# Altium schematic sheet Power Board.3.SchDoc
size A4; SheetNumber: 2; SheetTotal: 2
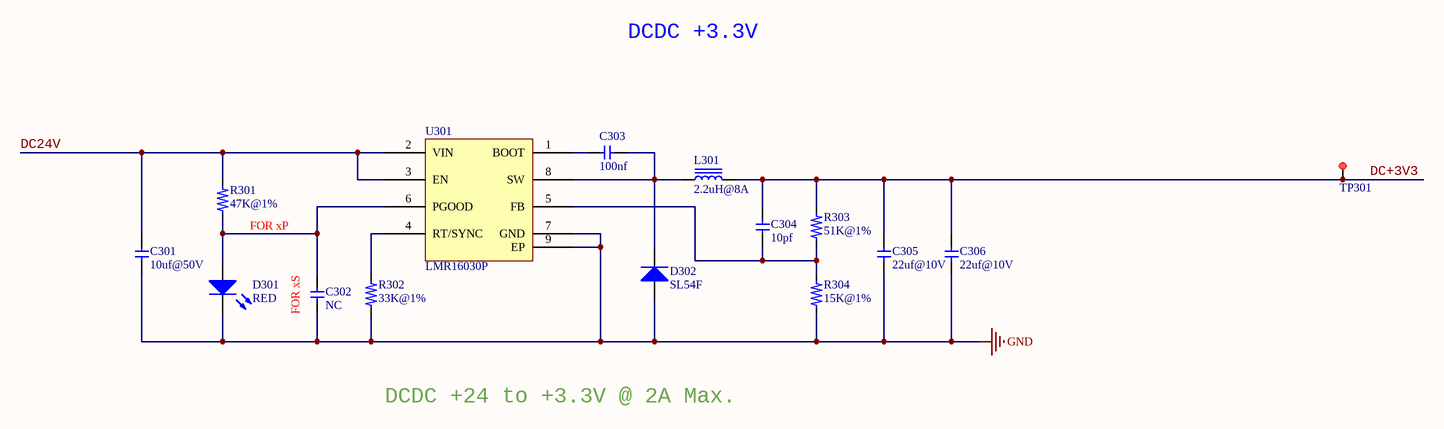
[diagram p0: Power Board.3.SchDoc]

## Parts
C301  value 10uf@50V  [C1206]  (hidden comment: Cap)
C302  value NC  [C0603]  (hidden comment: Cap)
C303  value 100nf  [C0603]  (hidden comment: Cap)
C304  value 10pf  [C0603]  (hidden comment: Cap)
C305  value 22uf@10V  [C1206]  (hidden comment: Cap)
C306  value 22uf@10V  [C1206]  (hidden comment: Cap)
D301  value RED  [LED0603]  (hidden comment: LED)
D302  value SL54F  [DIODE-SMAF]  (hidden comment: Diode)
L301  value 2.2uH@8A  [L06063]  (hidden comment: Inductor Iron)
R301  value 47K@1%  [R0603]  (hidden comment: Res)
R302  value 33K@1%  [R0603]  (hidden comment: Res)
R303  value 51K@1%  [R0603]  (hidden comment: Res)
R304  value 15K@1%  [R0603]  (hidden comment: Res)
TP301  TestPoint  [TestPoint-SMD100]  (value not drawn)
U301  LMR16030P  [LMR16030-SOIC8]

## Nets
GND: C301.1 C302.1 C305.1 C306.1 D301.2(K) D302.1(A) R302.1 R304.1 U301.7(GND) U301.9(EP)
DC24V: C301.2 R301.2 U301.2(VIN) U301.3(EN)
DC+3V3: C304.1 C305.2 C306.2 L301.2 R303.2 TP301.1
NetC302_2: C302.2 D301.1(A) R301.1 U301.6(PGOOD)
NetC303_1: C303.1 D302.2(K) L301.1 U301.8(SW)
NetC303_2: C303.2 U301.1(BOOT)
NetC304_2: C304.2 R303.1 R304.2 U301.5(FB)
NetR302_2: R302.2 U301.4(RT/SYNC)

## Notes on the sheet
- DCDC +3.3V
- (near R301) FOR xP
- (near C302) FOR xS
- DCDC +24 to +3.3V @ 2A Max.

## Library data of the parts
D302 = Diode: 通用二极管
L301 = Inductor Iron: Magnetic-Core Inductor
R301-R304 = Res: 电阻
TP301 = TestPoint: 测试点
U301 = LMR16030P: LMR16030 SIMPLE SWITCHER® 60-V, 3-A Step-Down Converter With 40-µA IQ